# Altium schematic sheet Copy of EP1C6T144I8N.SchDoc: Sonar 4.4
size A3 portrait; ApprovedBy: Логвиненко; CheckedBy: Левинец; Author: Спеян; CompanyName: Garage; DrawnBy: 16; Engineer: ,; Organization: Device for; Address1: Protect During; Address2: a Zombie; Address3: Apocalypse; Address4: ....; DocumentNumber: Garage; Revision: 25; SheetNumber: 1; SheetTotal: 1; Scale: 1:1; Title2str: Сонар; ProcessInspection: Copy of EP1C6T144I8N.SchDoc; NormInspection: ,; Letter1Column: S; Letter2Column: -; Letter3Column: -; DocumentType: Схема електрическая принципиальная; Mass: .; FirstReferrence: SDE 525.1 111 017 ME; Grupa: gr. E-111; Time: Garage; Rule: 26; ImagePath: 18; Application_BuildNumber: 5
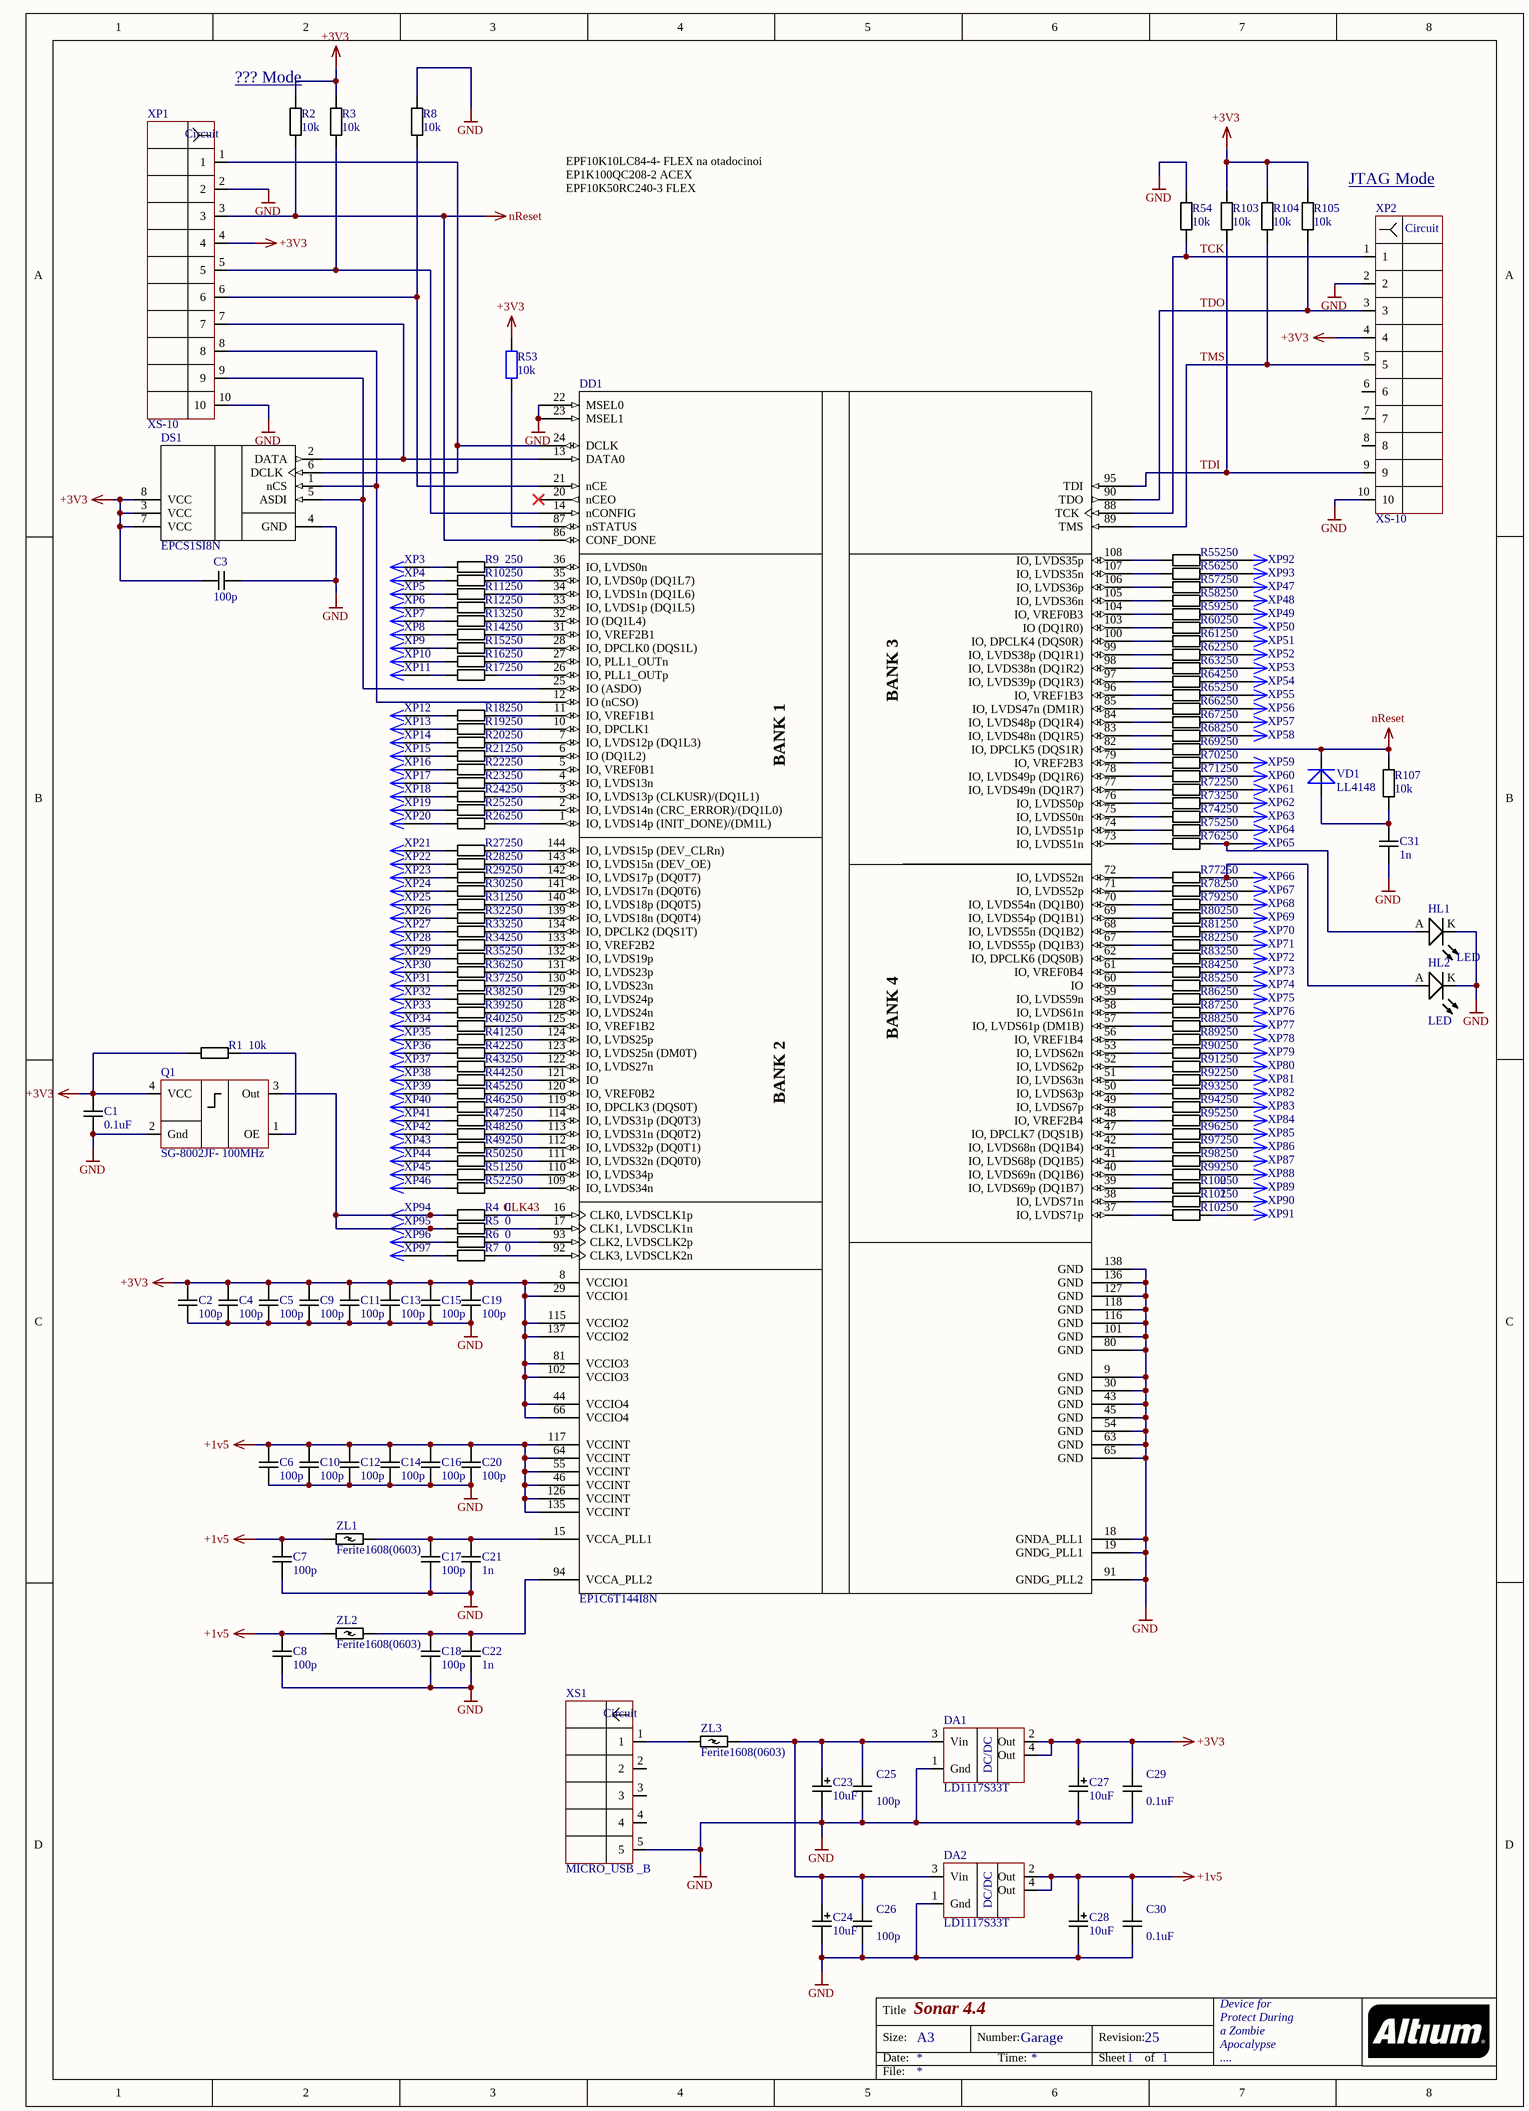
[diagram p0: Copy of EP1C6T144I8N.SchDoc]

## Parts
C1  0.1uF  [CapKemet1005(0402)]
C2  100p  [CapKemet1005(0402)]
C3  100p  [CapKemet1005(0402)]
C4  100p  [CapKemet1005(0402)]
C5  100p  [CapKemet1005(0402)]
C6  100p  [CapKemet1005(0402)]
C7  100p  [CapKemet1005(0402)]
C8  100p  [CapKemet1005(0402)]
C9  100p  [CapKemet1005(0402)]
C10  100p  [CapKemet1005(0402)]
C11  100p  [CapKemet1005(0402)]
C12  100p  [CapKemet1005(0402)]
C13  100p  [CapKemet1005(0402)]
C14  100p  [CapKemet1005(0402)]
C15  100p  [CapKemet1005(0402)]
C16  100p  [CapKemet1005(0402)]
C17  100p  [CapKemet1005(0402)]
C18  100p  [CapKemet1005(0402)]
C19  100p  [CapKemet1005(0402)]
C20  100p  [CapKemet1005(0402)]
C21  1n  [CapKemet1005(0402)]
C22  1n  [CapKemet1005(0402)]
C23  10uF  [0402-A]
C24  10uF  [0402-A]
C25  100p  [CapKemet1005(0402)]
C26  100p  [CapKemet1005(0402)]
C27  10uF  [0402-A]
C28  10uF  [0402-A]
C29  0.1uF  [CapKemet1005(0402)]
C30  0.1uF  [CapKemet1005(0402)]
C31  1n  [CapKemet1005(0402)]
DA1  LD1117S33T  [SOT223_M]
DA2  LD1117S33T  [SOT223_M]
DD1  EP1C6T144I8N  [TQFP144_N]
DS1  EPCS1SI8N  [SO8_N]
HL1  LED  [LED-0603-BLUE]
HL2  LED  [LED-0603-GREEN]
Q1  SG-8002JF- 100MHz  [SG-8002JF]
R1  10k  [REZKemet 0402]
R2  10k  [REZKemet 0402]
R3  10k  [REZKemet 0402]
R4  0  [REZKemet 0402]
R5  0  [REZKemet 0402]
R6  0  [REZKemet 0402]
R7  0  [REZKemet 0402]
R8  10k  [REZKemet 0402]
R9  250  [REZKemet 0402]
R10  250  [REZKemet 0402]
R11  250  [REZKemet 0402]
R12  250  [REZKemet 0402]
R13  250  [REZKemet 0402]
R14  250  [REZKemet 0402]
R15  250  [REZKemet 0402]
R16  250  [REZKemet 0402]
R17  250  [REZKemet 0402]
R18  250  [REZKemet 0402]
R19  250  [REZKemet 0402]
R20  250  [REZKemet 0402]
R21  250  [REZKemet 0402]
R22  250  [REZKemet 0402]
R23  250  [REZKemet 0402]
R24  250  [REZKemet 0402]
R25  250  [REZKemet 0402]
R26  250  [REZKemet 0402]
R27  250  [REZKemet 0402]
R28  250  [REZKemet 0402]
R29  250  [REZKemet 0402]
R30  250  [REZKemet 0402]
R31  250  [REZKemet 0402]
R32  250  [REZKemet 0402]
R33  250  [REZKemet 0402]
R34  250  [REZKemet 0402]
R35  250  [REZKemet 0402]
R36  250  [REZKemet 0402]
R37  250  [REZKemet 0402]
R38  250  [REZKemet 0402]
R39  250  [REZKemet 0402]
R40  250  [REZKemet 0402]
R41  250  [REZKemet 0402]
R42  250  [REZKemet 0402]
R43  250  [REZKemet 0402]
R44  250  [REZKemet 0402]
R45  250  [REZKemet 0402]
R46  250  [REZKemet 0402]
R47  250  [REZKemet 0402]
R48  250  [REZKemet 0402]
R49  250  [REZKemet 0402]
R50  250  [REZKemet 0402]
R51  250  [REZKemet 0402]
R52  250  [REZKemet 0402]
R53  10k  [REZKemet 0402]
R54  10k  [REZKemet 0402]
R55  250  [REZKemet 0402]
R56  250  [REZKemet 0402]
R57  250  [REZKemet 0402]
R58  250  [REZKemet 0402]
R59  250  [REZKemet 0402]
R60  250  [REZKemet 0402]
R61  250  [REZKemet 0402]
R62  250  [REZKemet 0402]
R63  250  [REZKemet 0402]
R64  250  [REZKemet 0402]
R65  250  [REZKemet 0402]
R66  250  [REZKemet 0402]
R67  250  [REZKemet 0402]
R68  250  [REZKemet 0402]
R69  250  [REZKemet 0402]
R70  250  [REZKemet 0402]
R71  250  [REZKemet 0402]
R72  250  [REZKemet 0402]
R73  250  [REZKemet 0402]
R74  250  [REZKemet 0402]
R75  250  [REZKemet 0402]
R76  250  [REZKemet 0402]
R77  250  [REZKemet 0402]
R78  250  [REZKemet 0402]
R79  250  [REZKemet 0402]
R80  250  [REZKemet 0402]
R81  250  [REZKemet 0402]
R82  250  [REZKemet 0402]
R83  250  [REZKemet 0402]
R84  250  [REZKemet 0402]
R85  250  [REZKemet 0402]
R86  250  [REZKemet 0402]
R87  250  [REZKemet 0402]
R88  250  [REZKemet 0402]
R89  250  [REZKemet 0402]
R90  250  [REZKemet 0402]
R91  250  [REZKemet 0402]
R92  250  [REZKemet 0402]
R93  250  [REZKemet 0402]
R94  250  [REZKemet 0402]
R95  250  [REZKemet 0402]
R96  250  [REZKemet 0402]
R97  250  [REZKemet 0402]
R98  250  [REZKemet 0402]
R99  250  [REZKemet 0402]
R100  250  [REZKemet 0402]
R101  250  [REZKemet 0402]
R102  250  [REZKemet 0402]
R103  10k  [REZKemet 0402]
R104  10k  [REZKemet 0402]
R105  10k  [REZKemet 0402]
R107  10k  [REZKemet 0402]
VD1  LL4148  [SOD80]
XP1  XS-10  [ISP 10(1.27mm)]
XP2  XS-10  [ISP 10(1.27mm)]
XP3  P50-B1(DIP)  [PLLS1.27-1]  (value not drawn)
XP4  P50-B1(DIP)  [PLLS1.27-1]  (value not drawn)
XP5  P50-B1(DIP)  [PLLS1.27-1]  (value not drawn)
XP6  P50-B1(DIP)  [PLLS1.27-1]  (value not drawn)
XP7  P50-B1(DIP)  [PLLS1.27-1]  (value not drawn)
XP8  P50-B1(DIP)  [PLLS1.27-1]  (value not drawn)
XP9  P50-B1(DIP)  [PLLS1.27-1]  (value not drawn)
XP10  P50-B1(DIP)  [PLLS1.27-1]  (value not drawn)
XP11  P50-B1(DIP)  [PLLS1.27-1]  (value not drawn)
XP12  P50-B1(DIP)  [PLLS1.27-1]  (value not drawn)
XP13  P50-B1(DIP)  [PLLS1.27-1]  (value not drawn)
XP14  P50-B1(DIP)  [PLLS1.27-1]  (value not drawn)
XP15  P50-B1(DIP)  [PLLS1.27-1]  (value not drawn)
XP16  P50-B1(DIP)  [PLLS1.27-1]  (value not drawn)
XP17  P50-B1(DIP)  [PLLS1.27-1]  (value not drawn)
XP18  P50-B1(DIP)  [PLLS1.27-1]  (value not drawn)
XP19  P50-B1(DIP)  [PLLS1.27-1]  (value not drawn)
XP20  P50-B1(DIP)  [PLLS1.27-1]  (value not drawn)
XP21  P50-B1(DIP)  [PLLS1.27-1]  (value not drawn)
XP22  P50-B1(DIP)  [PLLS1.27-1]  (value not drawn)
XP23  P50-B1(DIP)  [PLLS1.27-1]  (value not drawn)
XP24  P50-B1(DIP)  [PLLS1.27-1]  (value not drawn)
XP25  P50-B1(DIP)  [PLLS1.27-1]  (value not drawn)
XP26  P50-B1(DIP)  [PLLS1.27-1]  (value not drawn)
XP27  P50-B1(DIP)  [PLLS1.27-1]  (value not drawn)
XP28  P50-B1(DIP)  [PLLS1.27-1]  (value not drawn)
XP29  P50-B1(DIP)  [PLLS1.27-1]  (value not drawn)
XP30  P50-B1(DIP)  [PLLS1.27-1]  (value not drawn)
XP31  P50-B1(DIP)  [PLLS1.27-1]  (value not drawn)
XP32  P50-B1(DIP)  [PLLS1.27-1]  (value not drawn)
XP33  P50-B1(DIP)  [PLLS1.27-1]  (value not drawn)
XP34  P50-B1(DIP)  [PLLS1.27-1]  (value not drawn)
XP35  P50-B1(DIP)  [PLLS1.27-1]  (value not drawn)
XP36  P50-B1(DIP)  [PLLS1.27-1]  (value not drawn)
XP37  P50-B1(DIP)  [PLLS1.27-1]  (value not drawn)
XP38  P50-B1(DIP)  [PLLS1.27-1]  (value not drawn)
XP39  P50-B1(DIP)  [PLLS1.27-1]  (value not drawn)
XP40  P50-B1(DIP)  [PLLS1.27-1]  (value not drawn)
XP41  P50-B1(DIP)  [PLLS1.27-1]  (value not drawn)
XP42  P50-B1(DIP)  [PLLS1.27-1]  (value not drawn)
XP43  P50-B1(DIP)  [PLLS1.27-1]  (value not drawn)
XP44  P50-B1(DIP)  [PLLS1.27-1]  (value not drawn)
XP45  P50-B1(DIP)  [PLLS1.27-1]  (value not drawn)
XP46  P50-B1(DIP)  [PLLS1.27-1]  (value not drawn)
XP47  P50-B1(DIP)  [PLLS1.27-1]  (value not drawn)
XP48  P50-B1(DIP)  [PLLS1.27-1]  (value not drawn)
XP49  P50-B1(DIP)  [PLLS1.27-1]  (value not drawn)
XP50  P50-B1(DIP)  [PLLS1.27-1]  (value not drawn)
XP51  P50-B1(DIP)  [PLLS1.27-1]  (value not drawn)
XP52  P50-B1(DIP)  [PLLS1.27-1]  (value not drawn)
XP53  P50-B1(DIP)  [PLLS1.27-1]  (value not drawn)
XP54  P50-B1(DIP)  [PLLS1.27-1]  (value not drawn)
XP55  P50-B1(DIP)  [PLLS1.27-1]  (value not drawn)
XP56  P50-B1(DIP)  [PLLS1.27-1]  (value not drawn)
XP57  P50-B1(DIP)  [PLLS1.27-1]  (value not drawn)
XP58  P50-B1(DIP)  [PLLS1.27-1]  (value not drawn)
XP59  P50-B1(DIP)  [PLLS1.27-1]  (value not drawn)
XP60  P50-B1(DIP)  [PLLS1.27-1]  (value not drawn)
XP61  P50-B1(DIP)  [PLLS1.27-1]  (value not drawn)
XP62  P50-B1(DIP)  [PLLS1.27-1]  (value not drawn)
XP63  P50-B1(DIP)  [PLLS1.27-1]  (value not drawn)
XP64  P50-B1(DIP)  [PLLS1.27-1]  (value not drawn)
XP65  P50-B1(DIP)  [PLLS1.27-1]  (value not drawn)
XP66  P50-B1(DIP)  [PLLS1.27-1]  (value not drawn)
XP67  P50-B1(DIP)  [PLLS1.27-1]  (value not drawn)
XP68  P50-B1(DIP)  [PLLS1.27-1]  (value not drawn)
XP69  P50-B1(DIP)  [PLLS1.27-1]  (value not drawn)
XP70  P50-B1(DIP)  [PLLS1.27-1]  (value not drawn)
XP71  P50-B1(DIP)  [PLLS1.27-1]  (value not drawn)
XP72  P50-B1(DIP)  [PLLS1.27-1]  (value not drawn)
XP73  P50-B1(DIP)  [PLLS1.27-1]  (value not drawn)
XP74  P50-B1(DIP)  [PLLS1.27-1]  (value not drawn)
XP75  P50-B1(DIP)  [PLLS1.27-1]  (value not drawn)
XP76  P50-B1(DIP)  [PLLS1.27-1]  (value not drawn)
XP77  P50-B1(DIP)  [PLLS1.27-1]  (value not drawn)
XP78  P50-B1(DIP)  [PLLS1.27-1]  (value not drawn)
XP79  P50-B1(DIP)  [PLLS1.27-1]  (value not drawn)
XP80  P50-B1(DIP)  [PLLS1.27-1]  (value not drawn)
XP81  P50-B1(DIP)  [PLLS1.27-1]  (value not drawn)
XP82  P50-B1(DIP)  [PLLS1.27-1]  (value not drawn)
XP83  P50-B1(DIP)  [PLLS1.27-1]  (value not drawn)
XP84  P50-B1(DIP)  [PLLS1.27-1]  (value not drawn)
XP85  P50-B1(DIP)  [PLLS1.27-1]  (value not drawn)
XP86  P50-B1(DIP)  [PLLS1.27-1]  (value not drawn)
XP87  P50-B1(DIP)  [PLLS1.27-1]  (value not drawn)
XP88  P50-B1(DIP)  [PLLS1.27-1]  (value not drawn)
XP89  P50-B1(DIP)  [PLLS1.27-1]  (value not drawn)
XP90  P50-B1(DIP)  [PLLS1.27-1]  (value not drawn)
XP91  P50-B1(DIP)  [PLLS1.27-1]  (value not drawn)
XP92  PLLS1.27-1  [PLLS1.27-1]  (value not drawn)
XP93  PLLS1.27-1  [PLLS1.27-1]  (value not drawn)
XP94  PLLS1.27-1  [PLLS1.27-1]  (value not drawn)
XP95  PLLS1.27-1  [PLLS1.27-1]  (value not drawn)
XP96  PLLS1.27-1  [PLLS1.27-1]  (value not drawn)
XP97  PLLS1.27-1  [PLLS1.27-1]  (value not drawn)
XS1  MICRO_USB _B  [MICRO_USB _B]
ZL1  Ferite1608(0603)  [INDC1608(0603)N]
ZL2  Ferite1608(0603)  [INDC1608(0603)N]
ZL3  Ferite1608(0603)  [INDC1608(0603)N]

## Nets
+1v5: C6.1 C7.1 C8.1 C10.1 C12.1 C14.1 C16.1 C20.1 C28.1 C30.2 DA2.2(Out) DA2.4(Out) DD1.46(VCCINT) DD1.55(VCCINT) DD1.64(VCCINT) DD1.117(VCCINT) DD1.126(VCCINT) DD1.135(VCCINT) ZL1.1 ZL2.1
+3V3: C1.2 C2.1 C3.2 C4.1 C5.1 C9.1 C11.1 C13.1 C15.1 C19.1 C27.1 C29.2 DA1.2(Out) DA1.4(Out) DD1.8(VCCIO1) DD1.29(VCCIO1) DD1.44(VCCIO4) DD1.66(VCCIO4) DD1.81(VCCIO3) DD1.102(VCCIO3) DD1.115(VCCIO2) DD1.137(VCCIO2) DS1.3(VCC) DS1.7(VCC) DS1.8(VCC) Q1.4(VCC) R1.1 R2.2 R3.2 R53.2 R103.2 R104.2 R105.2 XP1.4 XP2.4
GND: C1.1 C2.2 C3.1 C4.2 C5.2 C6.2 C7.2 C8.2 C9.2 C10.2 C11.2 C12.2 C13.2 C14.2 C15.2 C16.2 C17.2 C18.2 C19.2 C20.2 C21.2 C22.2 C23.2 C24.2 C25.1 C26.1 C27.2 C28.2 C29.1 C30.1 C31.2 DA1.1(Gnd) DA2.1(Gnd) DD1.9(GND) DD1.18(GNDA_PLL1) DD1.19(GNDG_PLL1) DD1.22(MSEL0) DD1.23(MSEL1) DD1.30(GND) DD1.43(GND) DD1.45(GND) DD1.54(GND) DD1.63(GND) DD1.65(GND) DD1.80(GND) DD1.91(GNDG_PLL2) DD1.101(GND) DD1.116(GND) DD1.118(GND) DD1.127(GND) DD1.136(GND) DD1.138(GND) DS1.4(GND) HL1.K HL2.K Q1.2(Gnd) R8.2 R54.2 XP1.2 XP1.10 XP2.2 XP2.10 XS1.5
nReset: DD1.86(CONF_DONE) R2.1 R69.2 R107.1 VD1.2(K) XP1.3
CLK43: DD1.16(CLK0,_LVDSCLK1p) R4.2
TCK: DD1.88(TCK) R54.1 XP2.1
TDI: DD1.95(TDI) R103.1 XP2.9
TDO: DD1.90(TDO) R105.1 XP2.3
TMS: DD1.89(TMS) R104.1 XP2.5
NetC17_1: C17.1 C21.1 DD1.15(VCCA_PLL1) ZL1.2
NetC18_1: C18.1 C22.1 DD1.94(VCCA_PLL2) ZL2.2
NetC23_1: C23.1 C24.1 C25.2 C26.2 DA1.3(Vin) DA2.3(Vin) ZL3.2
NetC31_1: C31.1 R107.2 VD1.1(A)
NetDD1_1: DD1.1(IO,_LVDS14p_(INIT_DONE)/(DM1L)) R26.2
NetDD1_2: DD1.2(IO,_LVDS14n_(CRC_ERROR)/(DQ1L0)) R25.2
NetDD1_3: DD1.3(IO,_LVDS13p_(CLKUSR)/(DQ1L1)) R24.2
NetDD1_4: DD1.4(IO,_LVDS13n) R23.2
NetDD1_5: DD1.5(IO,_VREF0B1) R22.2
NetDD1_6: DD1.6(IO_(DQ1L2)) R21.2
NetDD1_7: DD1.7(IO,_LVDS12p_(DQ1L3)) R20.2
NetDD1_10: DD1.10(IO,_DPCLK1) R19.2
NetDD1_11: DD1.11(IO,_VREF1B1) R18.2
NetDD1_12: DD1.12(IO_(nCSO)) DS1.1(nCS) XP1.8
NetDD1_13: DD1.13(DATA0) DS1.2(DATA) XP1.7
NetDD1_14: DD1.14(nCONFIG) R3.1 XP1.5
NetDD1_17: DD1.17(CLK1,_LVDSCLK1n) R5.2
NetDD1_21: DD1.21(nCE) R8.1 XP1.6
NetDD1_24: DD1.24(DCLK) DS1.6(DCLK) XP1.1
NetDD1_25: DD1.25(IO_(ASDO)) DS1.5(ASDI) XP1.9
NetDD1_26: DD1.26(IO,_PLL1_OUTp) R17.2
NetDD1_27: DD1.27(IO,_PLL1_OUTn) R16.2
NetDD1_28: DD1.28(IO,_DPCLK0_(DQS1L)) R15.2
NetDD1_31: DD1.31(IO,_VREF2B1) R14.2
NetDD1_32: DD1.32(IO_(DQ1L4)) R13.2
NetDD1_33: DD1.33(IO,_LVDS1p_(DQ1L5)) R12.2
NetDD1_34: DD1.34(IO,_LVDS1n_(DQ1L6)) R11.2
NetDD1_35: DD1.35(IO,_LVDS0p_(DQ1L7)) R10.2
NetDD1_36: DD1.36(IO,_LVDS0n) R9.2
NetDD1_37: DD1.37(IO,_LVDS71p) R102.1
NetDD1_38: DD1.38(IO,_LVDS71n) R101.1
NetDD1_39: DD1.39(IO,_LVDS69p_(DQ1B7)) R100.1
NetDD1_40: DD1.40(IO,_LVDS69n_(DQ1B6)) R99.1
NetDD1_41: DD1.41(IO,_LVDS68p_(DQ1B5)) R98.1
NetDD1_42: DD1.42(IO,_LVDS68n_(DQ1B4)) R97.1
NetDD1_47: DD1.47(IO,_DPCLK7_(DQS1B)) R96.1
NetDD1_48: DD1.48(IO,_VREF2B4) R95.1
NetDD1_49: DD1.49(IO,_LVDS67p) R94.1
NetDD1_50: DD1.50(IO,_LVDS63p) R93.1
NetDD1_51: DD1.51(IO,_LVDS63n) R92.1
NetDD1_52: DD1.52(IO,_LVDS62p) R91.1
NetDD1_53: DD1.53(IO,_LVDS62n) R90.1
NetDD1_56: DD1.56(IO,_VREF1B4) R89.1
NetDD1_57: DD1.57(IO,_LVDS61p_(DM1B)) R88.1
NetDD1_58: DD1.58(IO,_LVDS61n) R87.1
NetDD1_59: DD1.59(IO,_LVDS59n) R86.1
NetDD1_60: DD1.60(IO) R85.1
NetDD1_61: DD1.61(IO,_VREF0B4) R84.1
NetDD1_62: DD1.62(IO,_DPCLK6_(DQS0B)) R83.1
NetDD1_67: DD1.67(IO,_LVDS55p_(DQ1B3)) R82.1
NetDD1_68: DD1.68(IO,_LVDS55n_(DQ1B2)) R81.1
NetDD1_69: DD1.69(IO,_LVDS54p_(DQ1B1)) R80.1
NetDD1_70: DD1.70(IO,_LVDS54n_(DQ1B0)) R79.1
NetDD1_71: DD1.71(IO,_LVDS52p) R78.1
NetDD1_72: DD1.72(IO,_LVDS52n) R77.1
NetDD1_73: DD1.73(IO,_LVDS51n) R76.1
NetDD1_74: DD1.74(IO,_LVDS51p) R75.1
NetDD1_75: DD1.75(IO,_LVDS50n) R74.1
NetDD1_76: DD1.76(IO,_LVDS50p) R73.1
NetDD1_77: DD1.77(IO,_LVDS49n_(DQ1R7)) R72.1
NetDD1_78: DD1.78(IO,_LVDS49p_(DQ1R6)) R71.1
NetDD1_79: DD1.79(IO,_VREF2B3) R70.1
NetDD1_82: DD1.82(IO,_DPCLK5_(DQS1R)) R69.1
NetDD1_83: DD1.83(IO,_LVDS48n_(DQ1R5)) R68.1
NetDD1_84: DD1.84(IO,_LVDS48p_(DQ1R4)) R67.1
NetDD1_85: DD1.85(IO,_LVDS47n_(DM1R)) R66.1
NetDD1_87: DD1.87(nSTATUS) R53.1
NetDD1_92: DD1.92(CLK3,_LVDSCLK2n) R7.2
NetDD1_93: DD1.93(CLK2,_LVDSCLK2p) R6.2
NetDD1_96: DD1.96(IO,_VREF1B3) R65.1
NetDD1_97: DD1.97(IO,_LVDS39p_(DQ1R3)) R64.1
NetDD1_98: DD1.98(IO,_LVDS38n_(DQ1R2)) R63.1
NetDD1_99: DD1.99(IO,_LVDS38p_(DQ1R1)) R62.1
NetDD1_100: DD1.100(IO,_DPCLK4_(DQS0R)) R61.1
NetDD1_103: DD1.103(IO_(DQ1R0)) R60.1
NetDD1_104: DD1.104(IO,_VREF0B3) R59.1
NetDD1_105: DD1.105(IO,_LVDS36n) R58.1
NetDD1_106: DD1.106(IO,_LVDS36p) R57.1
NetDD1_107: DD1.107(IO,_LVDS35n) R56.1
NetDD1_108: DD1.108(IO,_LVDS35p) R55.1
NetDD1_109: DD1.109(IO,_LVDS34n) R52.2
NetDD1_110: DD1.110(IO,_LVDS34p) R51.2
NetDD1_111: DD1.111(IO,_LVDS32n_(DQ0T0)) R50.2
NetDD1_112: DD1.112(IO,_LVDS32p_(DQ0T1)) R49.2
NetDD1_113: DD1.113(IO,_LVDS31n_(DQ0T2)) R48.2
NetDD1_114: DD1.114(IO,_LVDS31p_(DQ0T3)) R47.2
NetDD1_119: DD1.119(IO,_DPCLK3_(DQS0T)) R46.2
NetDD1_120: DD1.120(IO,_VREF0B2) R45.2
NetDD1_121: DD1.121(IO) R44.2
NetDD1_122: DD1.122(IO,_LVDS27n) R43.2
NetDD1_123: DD1.123(IO,_LVDS25n_(DM0T)) R42.2
NetDD1_124: DD1.124(IO,_LVDS25p) R41.2
NetDD1_125: DD1.125(IO,_VREF1B2) R40.2
NetDD1_128: DD1.128(IO,_LVDS24n) R39.2
NetDD1_129: DD1.129(IO,_LVDS24p) R38.2
NetDD1_130: DD1.130(IO,_LVDS23n) R37.2
NetDD1_131: DD1.131(IO,_LVDS23p) R36.2
NetDD1_132: DD1.132(IO,_LVDS19p) R35.2
NetDD1_133: DD1.133(IO,_VREF2B2) R34.2
NetDD1_134: DD1.134(IO,_DPCLK2_(DQS1T)) R33.2
NetDD1_139: DD1.139(IO,_LVDS18n_(DQ0T4)) R32.2
NetDD1_140: DD1.140(IO,_LVDS18p_(DQ0T5)) R31.2
NetDD1_141: DD1.141(IO,_LVDS17n_(DQ0T6)) R30.2
NetDD1_142: DD1.142(IO,_LVDS17p_(DQ0T7)) R29.2
NetDD1_143: DD1.143(IO,_LVDS15n_(DEV_OE)) R28.2
NetDD1_144: DD1.144(IO,_LVDS15p_(DEV_CLRn)) R27.2
NetHL1_A: HL1.A R76.2 XP65.1
NetHL2_A: HL2.A R77.2 XP66.1
NetQ1_1: Q1.1(OE) R1.2
NetQ1_3: Q1.3(Out) R4.1 R5.1 XP94.1 XP95.1
NetR6_1: R6.1 XP96.1
NetR7_1: R7.1 XP97.1
NetR9_1: R9.1 XP3.1
NetR10_1: R10.1 XP4.1
NetR11_1: R11.1 XP5.1
NetR12_1: R12.1 XP6.1
NetR13_1: R13.1 XP7.1
NetR14_1: R14.1 XP8.1
NetR15_1: R15.1 XP9.1
NetR16_1: R16.1 XP10.1
NetR17_1: R17.1 XP11.1
NetR18_1: R18.1 XP12.1
NetR19_1: R19.1 XP13.1
NetR20_1: R20.1 XP14.1
NetR21_1: R21.1 XP15.1
NetR22_1: R22.1 XP16.1
NetR23_1: R23.1 XP17.1
NetR24_1: R24.1 XP18.1
NetR25_1: R25.1 XP19.1
NetR26_1: R26.1 XP20.1
NetR27_1: R27.1 XP21.1
NetR28_1: R28.1 XP22.1
NetR29_1: R29.1 XP23.1
NetR30_1: R30.1 XP24.1
NetR31_1: R31.1 XP25.1
NetR32_1: R32.1 XP26.1
NetR33_1: R33.1 XP27.1
NetR34_1: R34.1 XP28.1
NetR35_1: R35.1 XP29.1
NetR36_1: R36.1 XP30.1
NetR37_1: R37.1 XP31.1
NetR38_1: R38.1 XP32.1
NetR39_1: R39.1 XP33.1
NetR40_1: R40.1 XP34.1
NetR41_1: R41.1 XP35.1
NetR42_1: R42.1 XP36.1
NetR43_1: R43.1 XP37.1
NetR44_1: R44.1 XP38.1
NetR45_1: R45.1 XP39.1
NetR46_1: R46.1 XP40.1
NetR47_1: R47.1 XP41.1
NetR48_1: R48.1 XP42.1
NetR49_1: R49.1 XP43.1
NetR50_1: R50.1 XP44.1
NetR51_1: R51.1 XP45.1
NetR52_1: R52.1 XP46.1
NetR55_2: R55.2 XP92.1
NetR56_2: R56.2 XP93.1
NetR57_2: R57.2 XP47.1
NetR58_2: R58.2 XP48.1
NetR59_2: R59.2 XP49.1
NetR60_2: R60.2 XP50.1
NetR61_2: R61.2 XP51.1
NetR62_2: R62.2 XP52.1
NetR63_2: R63.2 XP53.1
NetR64_2: R64.2 XP54.1
NetR65_2: R65.2 XP55.1
NetR66_2: R66.2 XP56.1
NetR67_2: R67.2 XP57.1
NetR68_2: R68.2 XP58.1
NetR70_2: R70.2 XP59.1
NetR71_2: R71.2 XP60.1
NetR72_2: R72.2 XP61.1
NetR73_2: R73.2 XP62.1
NetR74_2: R74.2 XP63.1
NetR75_2: R75.2 XP64.1
NetR78_2: R78.2 XP67.1
NetR79_2: R79.2 XP68.1
NetR80_2: R80.2 XP69.1
NetR81_2: R81.2 XP70.1
NetR82_2: R82.2 XP71.1
NetR83_2: R83.2 XP72.1
NetR84_2: R84.2 XP73.1
NetR85_2: R85.2 XP74.1
NetR86_2: R86.2 XP75.1
NetR87_2: R87.2 XP76.1
NetR88_2: R88.2 XP77.1
NetR89_2: R89.2 XP78.1
NetR90_2: R90.2 XP79.1
NetR91_2: R91.2 XP80.1
NetR92_2: R92.2 XP81.1
NetR93_2: R93.2 XP82.1
NetR94_2: R94.2 XP83.1
NetR95_2: R95.2 XP84.1
NetR96_2: R96.2 XP85.1
NetR97_2: R97.2 XP86.1
NetR98_2: R98.2 XP87.1
NetR99_2: R99.2 XP88.1
NetR100_2: R100.2 XP89.1
NetR101_2: R101.2 XP90.1
NetR102_2: R102.2 XP91.1
NetXS1_1: XS1.1 ZL3.1

Not connected (* = marked no-connect by the designer): DD1 20(nCEO)*; XP2 6 7 8; XS1 2 3 4

## Notes on the sheet
- ??? Mode
- EPF10K10LC84-4- FLEX na otadocinoi
  EP1K100QC208-2 ACEX
  EPF10K50RC240-3 FLEX
- JTAG Mode
- Title
- Size:
- Date:
- A3
- Number:
- Time:
- Revision:
- Sheet
- of
- File:
- (in symbol 3220-10-0100-00) Circuit
- (in symbol EP1C6T144I8N) BANK 1; BANK 3; BANK 2; BANK 4
- (in symbol LD1117S33T) DC/DC
- (in symbol MICRO_USB _B) Circuit

## Library data of the parts
C1-C22 C25 C26 C29-C31 = CAPC1005(0402)N: Part Number: CAPC1005(0402)N; Digi-Key Part Number: ?; HelpURL: ?; Manufacturer Part Number: ?; Note: ?; Package: ?; Price$: ?
C23 C24 C27 C28 = CapTantA: Part Number: CapTantA
DS1 = EPCS1SI8N: IC CONFIG DEVICE 1MBIT 8SOIC; Configures: Cyclone II, Stratix II, & Cyclone Devices; Published: 17-Sep-2003; LatestRevisionDate: 13-Apr-2006; LatestRevisionNote: IPC-7351 Footprint Added.; DatasheetVersion: ver2.0, Oct-2003; PackageVersion: ver14.2, Oct-2005; PackageReference: SOIC8; Publisher: Altium Limited; PackageDescription: 8-Pin Small Outline Integrated Circuit Package (SOIC8); Supplier 1: Digi-Key; Supplier Part Number 1: 544-1241-5-ND; Code_JEDEC: MS-012-AA; Code_IPC: SOIC127P600-8; ComponentLink1Description: Manufacturer Link; ComponentLink1URL: http://www.altera.com/products/devices/config/cfg-index.html; ComponentLink2Description: Configuration Handbook; ComponentLink2URL: http://www.altera.com/literature/hb/cfg/config_handbook.pdf; ComponentLink3Description: Pinout Specification; ComponentLink3URL: http://www.altera.com/literature/hb/cfg/cyc_c51014.pdf; ComponentLink4Description: Packaging Specification; ComponentLink4URL: http://www.altera.com/literature/ds/dspkg.pdf; Part Number: EPCS1SI8N; HelpURL: https://www.altera.com/en_US/pdfs/literature/hb/cfg/cyc_c51014.pdf; Price$: 4.02
HL1 = LED-0603-BLUE: LED BLUE DIFFUSED 0603 SMD; Manufacturer Part Number: 150060BS55040; Part Number: LED-0603-BLUE; HelpURL: https://www.digikey.com/products/en?keywords=732-12013-1-ND; Digi-Key Part Number: 732-12013-1-ND; Price$: ?; Note: ?; Package: 0603
HL2 = LED-0603-GREEN: LED GREEN DIFFUSED 0603 SMD; Manufacturer Part Number: 150060VS55040; Part Number: LED-0603-GREEN; HelpURL: https://www.digikey.com/products/en?keywords=732-12017-1-ND; Digi-Key Part Number: 732-12017-1-ND; Price$: ?; Note: ?; Package: ?
Q1 = SG-8002JF: Part Number: SG-8002JF
R1-R52 R54-R105 R107 = RESC1005(0402): Note: ???; Part Number: RESC1005(0402); HelpURL: ???; Digi-Key Part Number: ???; Price$: ???; Manufacturer Part Number: ???; Package: ???
R53 = RESC1005(0402): Resistor; Manufacturer Part Number: ???; Part Number: RESC1005(0402); Digi-Key Part Number: ???; HelpURL: ???; Note: ???; Package: ???; Price$: ???
VD1 = LL4148: Small Signal Diode; Published: 8-Jun-2000; LatestRevisionDate: 17-Jul-2002; LatestRevisionNote: Re-released for DXP Platform.; DatasheetVersion: 1997; PackageReference: DO-35; Publisher: Altium Limited; PackageDescription: Diode, Axial; Body 3.8 x 1.9 mm (LxDia. max), Lead Dia. 0.53 mm (max); Code_JEDEC: DO-204-AH; ComponentLink1Description: Manufacturer Link; ComponentLink1URL: http://www.fairchildsemi.com/; ComponentLink2Description: Datasheet; ComponentLink2URL: http://www.fairchildsemi.com/ds/1N%2F1N4148.pdf; Part Number: LL4148; HelpURL: https://www.fairchildsemi.com/datasheets/LL/LL4148.pdf; Price$: ?; Note: ?; Manufacturer Part Number: ?; Package: ?
XP1 XP2 = 3220-10-0100-00: Part Number: 3220-10-0100-00; Digi-Key Part Number: 1175-1627-ND; HelpURL: https://www.digikey.com/product-detail/en/cnc-tech/3220-10-0100-00/1175-1627-ND/3883661
XS1 = MICRO_USB _B: Note: ???; Part Number: MICRO_USB _B; HelpURL: https://www.digikey.com/product-detail/en/amphenol-icc-fci/10118194-0001LF/609-4618-1-ND/2785382; Digi-Key Part Number: ???; Price$: ???; Manufacturer Part Number: ???; Package: ???
ZL1-ZL3 = Ferite1608(0603): ferite bead; Note: ???; Part Number: Ferite1608(0603); Digi-Key Part Number: ???; Price$: ???; Manufacturer Part Number: ???; Package: ???
DA1 DA2 = LD1117S33T: Part Number: LD1117S33T; HelpURL: http://www.mouser.com/ds/2/389/CD00000544-310772.pdf
DD1 = EP1C6T144I8N: Published: 18-Aug-2005; LatestRevisionDate: 13-Apr-2006; LatestRevisionNote: Pin 2 name fix, IPC-7351 Footprint Added.; DatasheetVersion: ver2.4, May-2008; PackageVersion: ver15.4, Dec-2008; PackageReference: TQFP144; Publisher: Altium Limited; PackageDescription: 144-Pin Plastic Thin Quad Flat Pack (TQFP144) - Wire Bond; Code_JEDEC: MS-026-BFB; ComponentLink1Description: Manufacturer Link; ComponentLink1URL: http://www.altera.com/products/devices/cyclone/cyc-index.jsp; ComponentLink2Description: Handbook; ComponentLink2URL: http://www.altera.com/literature/hb/cyc/cyc_c5v1.pdf; ComponentLink3Description: Packaging Specification; ComponentLink3URL: http://www.altera.com/literature/ds/dspkg.pdf; Part Number: EP1C6T144I8N
XP3-XP91 = P50-B1(DIP): Part Number: P50-B1(DIP)
XP92-XP97 = PLLS1.27-1: Part Number: PLLS1.27-1